# Altium schematic sheet [09] - Ethernet.SchDoc
size A3
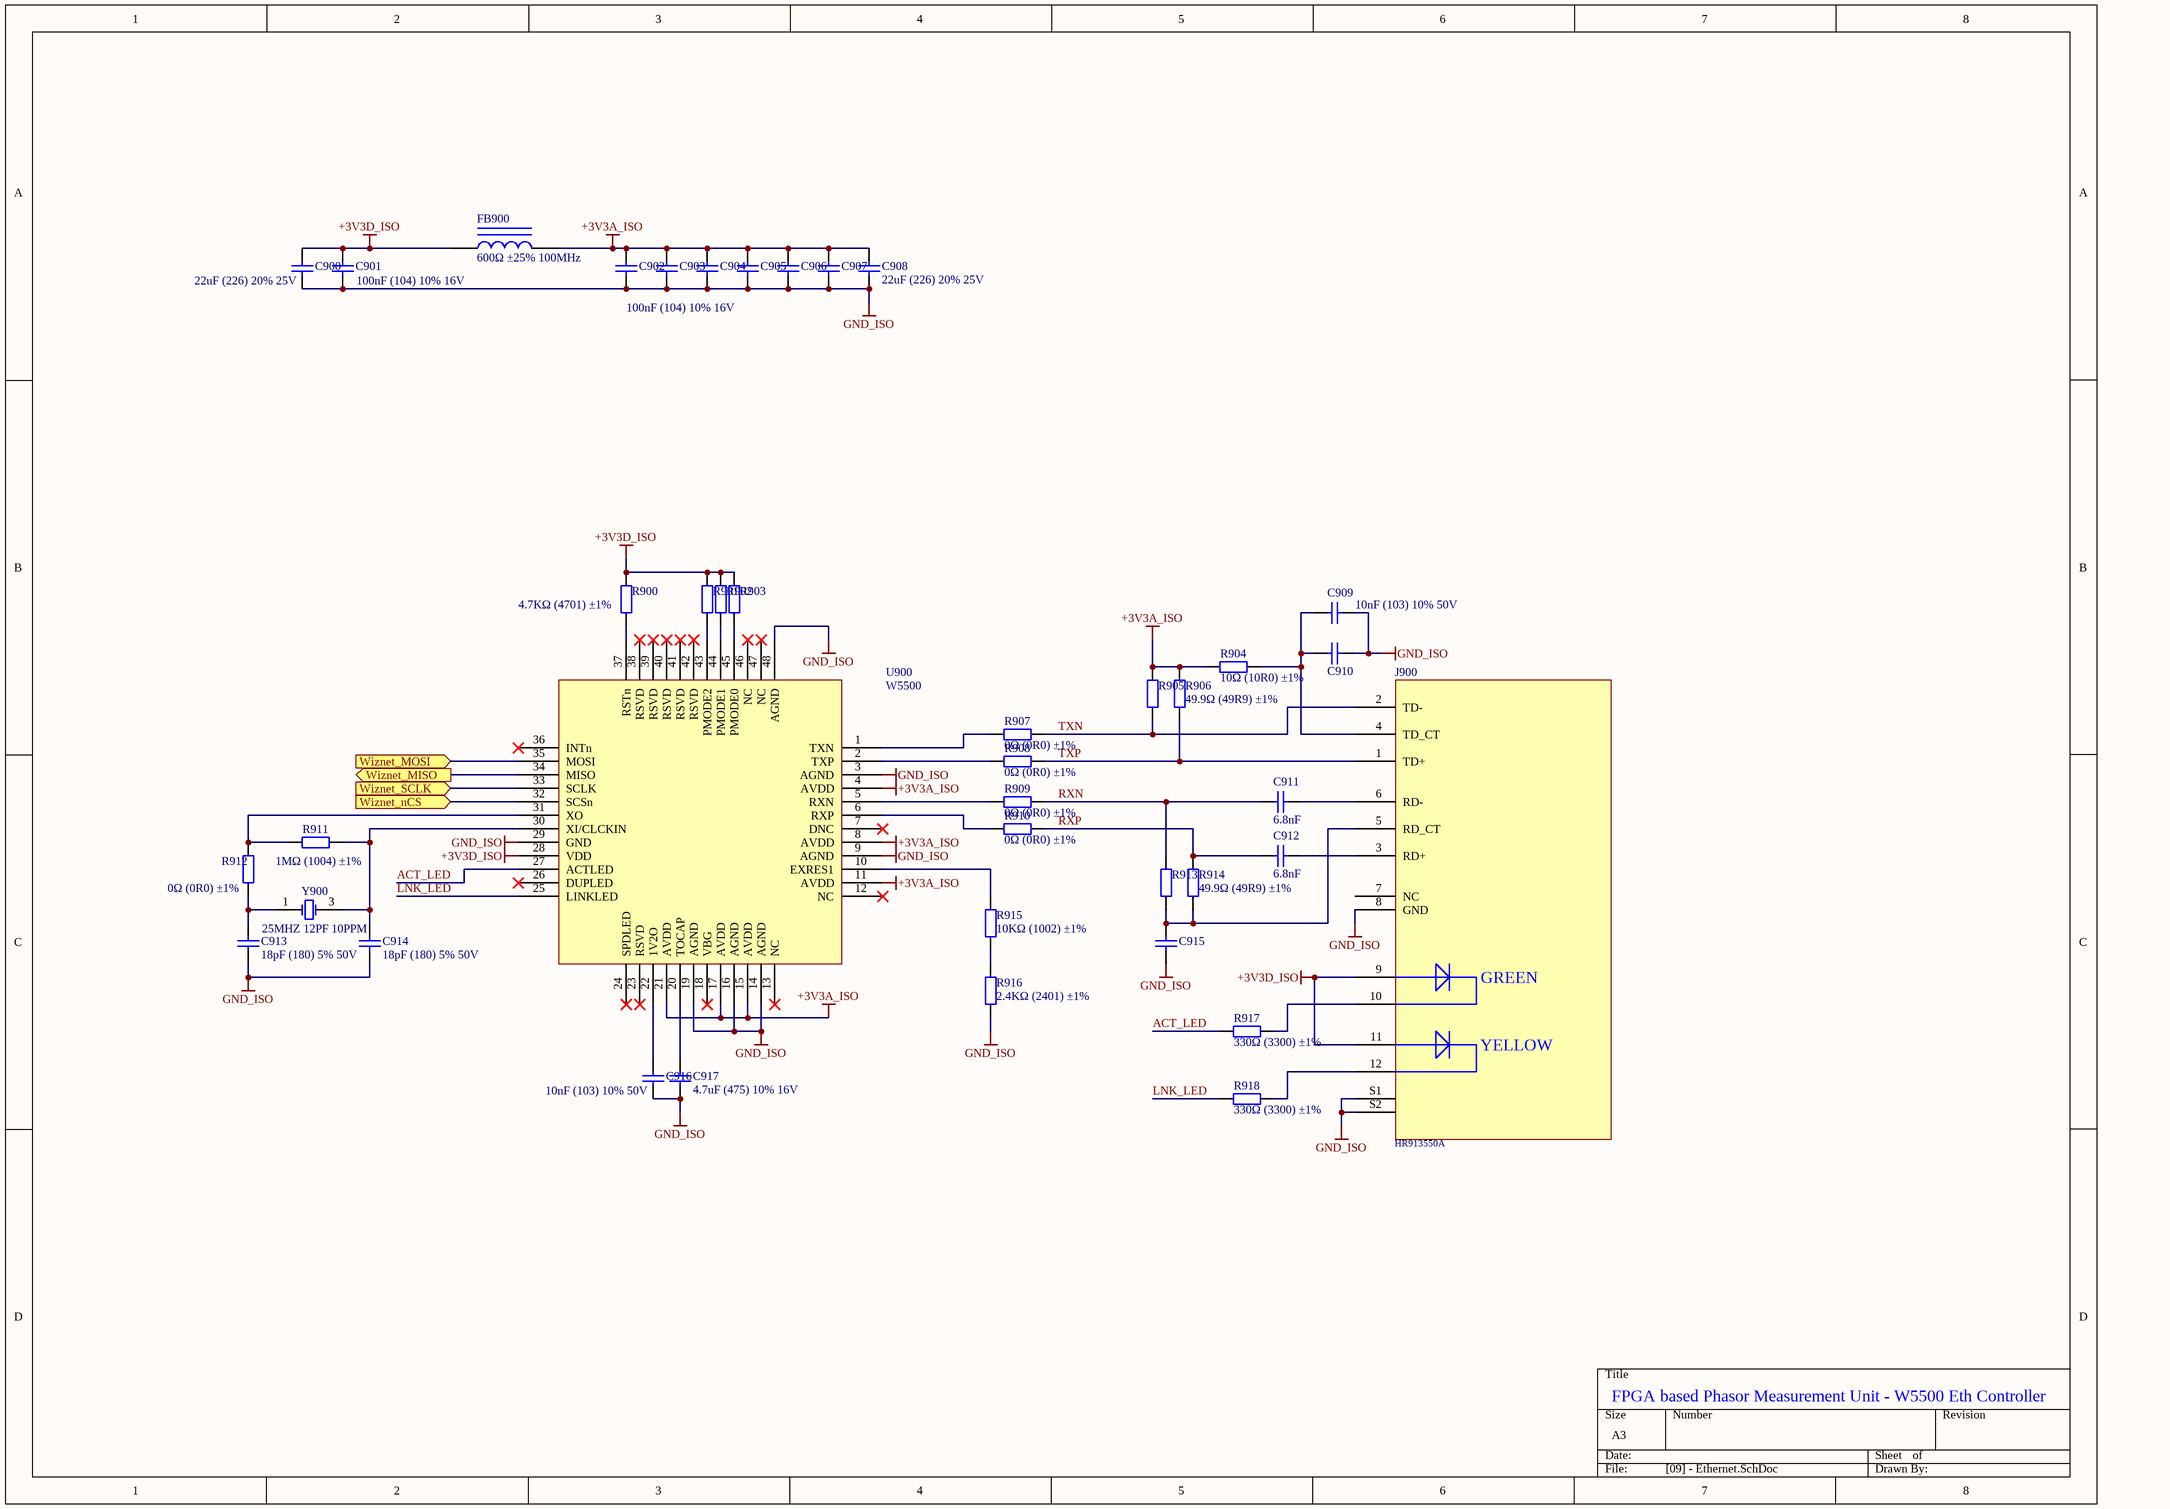
[diagram p0: [09] - Ethernet.SchDoc]

## Parts
C900  22uF (226) 20% 25V  [0805_C]
C901  100nF (104) 10% 16V  [0402_C]
C902  100nF (104) 10% 16V  [0402_C]
C903  100nF (104) 10% 16V  [0402_C]  (value not drawn)
C904  100nF (104) 10% 16V  [0402_C]  (value not drawn)
C905  100nF (104) 10% 16V  [0402_C]  (value not drawn)
C906  100nF (104) 10% 16V  [0402_C]  (value not drawn)
C907  100nF (104) 10% 16V  [0402_C]  (value not drawn)
C908  22uF (226) 20% 25V  [0805_C]
C909  10nF (103) 10% 50V  [0402_C]
C910  10nF (103) 10% 50V  [0402_C]  (value not drawn)
C911  6.8nF  [0402_C]
C912  6.8nF  [0402_C]
C913  18pF (180) 5% 50V  [0402_C]
C914  18pF (180) 5% 50V  [0402_C]
C915  10nF (103) 10% 50V  [0402_C]  (value not drawn)
C916  10nF (103) 10% 50V  [0402_C]
C917  4.7uF (475) 10% 16V  [0603_C]
FB900  600Ω ±25% 100MHz  [0805_L]
J900  HR913550A  [RJ45 MagJack]
R900  4.7KΩ (4701) ±1%  [0402_R]
R901  4.7KΩ (4701) ±1%  [0402_R]  (value not drawn)
R902  4.7KΩ (4701) ±1%  [0402_R]  (value not drawn)
R903  4.7KΩ (4701) ±1%  [0402_R]  (value not drawn)
R904  10Ω (10R0) ±1%  [0402_R]
R905  49.9Ω (49R9) ±1%  [0402_R]  (value not drawn)
R906  49.9Ω (49R9) ±1%  [0402_R]
R907  0Ω (0R0) ±1%  [0402_R]
R908  0Ω (0R0) ±1%  [0402_R]
R909  0Ω (0R0) ±1%  [0402_R]
R910  0Ω (0R0) ±1%  [0402_R]
R911  1MΩ (1004) ±1%  [0402_R]
R912  0Ω (0R0) ±1%  [0402_R]
R913  49.9Ω (49R9) ±1%  [0402_R]  (value not drawn)
R914  49.9Ω (49R9) ±1%  [0402_R]
R915  10KΩ (1002) ±1%  [0402_R]
R916  2.4KΩ (2401) ±1%  [0402_R]
R917  330Ω (3300) ±1%  [0603_R]
R918  330Ω (3300) ±1%  [0603_R]
U900  W5500  [LQFP-48_7x7x05P]
Y900  25MHZ 12PF 10PPM  [SMD-3225_4P]

## Ports
Wiznet_MISO (out), Wiznet_MOSI (in), Wiznet_nCS (in), Wiznet_SCLK (in)

## Nets
+3V3A_ISO: C902.2 C903.2 C904.2 C905.2 C906.2 C907.2 C908.2 FB900.2 R904.1 R905.2 R906.2 U900.4(AVDD) U900.8(AVDD) U900.11(AVDD) U900.15(AVDD) U900.17(AVDD) U900.21(AVDD)
+3V3D_ISO: C900.2 C901.2 FB900.1 J900.9 J900.11 R900.1 R901.2 R902.2 R903.2 U900.28(VDD)
GND_ISO: C900.1 C901.1 C902.1 C903.1 C904.1 C905.1 C906.1 C907.1 C908.1 C909.1 C910.1 C913.1 C914.1 C915.1 C916.1 C917.1 J900.8(GND) J900.S1 J900.S2 R916.1 U900.3(AGND) U900.9(AGND) U900.14(AGND) U900.16(AGND) U900.19(AGND) U900.29(GND) U900.48(AGND)
ACT_LED: R917.1 U900.27(ACTLED)
LNK_LED: R918.1 U900.25(LINKLED)
RXN: C911.1 R909.2 R913.2
RXP: C912.1 R910.2 R914.2
TXN: J900.2(TD-) R905.1 R907.2
TXP: J900.1(TD+) R906.1 R908.2
Wiznet_MISO: U900.34(MISO) ; port Wiznet_MISO
Wiznet_MOSI: U900.35(MOSI) ; port Wiznet_MOSI
Wiznet_nCS: U900.32(SCSn) ; port Wiznet_nCS
Wiznet_SCLK: U900.33(SCLK) ; port Wiznet_SCLK
NetC909_2: C909.2 C910.2 J900.4(TD_CT) R904.2
NetC911_2: C911.2 J900.6(RD-)
NetC912_2: C912.2 J900.3(RD+)
NetC913_2: C913.2 R912.1 Y900.1(OSC1)
NetC914_2: C914.2 R911.2 U900.30(XI/CLCKIN) Y900.3(OSC2)
NetC915_2: C915.2 J900.5(RD_CT) R913.1 R914.1
NetC916_2: C916.2 U900.22(1V2O)
NetC917_2: C917.2 U900.20(TOCAP)
NetJ900_10: J900.10 R917.2
NetJ900_12: J900.12 R918.2
NetR900_2: R900.2 U900.37(RSTn)
NetR901_1: R901.1 U900.43(PMODE2)
NetR902_1: R902.1 U900.44(PMODE1)
NetR903_1: R903.1 U900.45(PMODE0)
NetR907_1: R907.1 U900.1(TXN)
NetR908_1: R908.1 U900.2(TXP)
NetR909_1: R909.1 U900.5(RXN)
NetR910_1: R910.1 U900.6(RXP)
NetR911_1: R911.1 R912.2 U900.31(XO)
NetR915_1: R915.1 R916.2
NetR915_2: R915.2 U900.10(EXRES1)

Not connected (* = marked no-connect by the designer): J900 7(NC); U900 7(DNC)* 12(NC)* 13(NC)* 18(VBG)* 23(RSVD)* 24(SPDLED)* 26(DUPLED)* 36(INTn)* 38(RSVD)* 39(RSVD)* 40(RSVD)* 41(RSVD)* 42(RSVD)* 46(NC)* 47(NC)*

## Notes on the sheet
- FPGA based Phasor Measurement Unit - W5500 Eth Controller
- (in symbol HR913550A) GREEN; YELLOW

## Library data of the parts
C900 C908 = 0805 22uF (226) 20% 25V: 贴片电容; ComponentLink1Description: 供应商链接; ComponentLink1URL: http://www.szlcsc.com/product/details_46786.html; Package: 0805; Supplier: LC; SuppliersPartNumber: C45783
C901-C907 = 0402 100nF (104) 10% 16V: 贴片电容; ComponentLink1Description: 供应商链接; ComponentLink1URL: http://www.szlcsc.com/product/details_1877.html; Package: 0402; Supplier: LC; SuppliersPartNumber: C1525
C909 C910 C915 C916 = 0402 10nF (103) 10% 50V: 贴片电容; ComponentLink1Description: 供应商链接; ComponentLink1URL: http://www.szlcsc.com/product/details_15869.html; Package: 0402; Supplier: LC; SuppliersPartNumber: C15195
C911 C912 = 0402 6.8nF (682) 10% 50V: 贴片电容; ComponentLink1Description: 供应商链接; ComponentLink1URL: http://www.szlcsc.com/product/details_1894.html; Package: 0402; Supplier: LC; SuppliersPartNumber: C1542
C913 C914 = 0402 18pF (180) 5% 50V: 贴片电容; ComponentLink1Description: 供应商链接; ComponentLink1URL: http://www.szlcsc.com/product/details_1901.html; Package: 0402; Supplier: LC; SuppliersPartNumber: C1549
C917 = 0603 4.7uF (475) 10% 16V: 贴片电容; ComponentLink1Description: 供应商链接; ComponentLink1URL: http://www.szlcsc.com/product/details_20375.html; Package: 0603; Supplier: LC; SuppliersPartNumber: C19666
FB900 = 0805 600Ω 25% 100MHz: 贴片磁珠; ComponentLink1Description: 供应商链接; ComponentLink1URL: http://www.szlcsc.com/product/details_1369.html; Package: 0805; Supplier: LC; SuppliersPartNumber: C1017
J900 = HR913550A: RJ45 12 1 Green - Yellow Through Hole Ethernet Connectors/Modular Connectors (RJ45 RJ11) RoHS; JLCPCB: NO; SuppliersPartNumber: C163507
R900-R903 = 0402 4.7KΩ (4701) 1%: 贴片电阻; ComponentLink1Description: 供应商链接; ComponentLink1URL: http://www.szlcsc.com/product/details_26643.html; Package: 0402; Supplier: LC; SuppliersPartNumber: C25900
R904 = 0402 10Ω (10R0) 1%: 贴片电阻; ComponentLink1Description: 供应商链接; ComponentLink1URL: http://www.szlcsc.com/product/details_25820.html; Package: 0402; Supplier: LC; SuppliersPartNumber: C25077
R905 R906 R913 R914 = 0402 49.9Ω (49R9) 1%: 贴片电阻; ComponentLink1Description: 供应商链接; ComponentLink1URL: http://www.szlcsc.com/product/details_25863.html; Package: 0402; Supplier: LC; SuppliersPartNumber: C25120
R907-R910 R912 = 0402 0Ω (0R0) 1%: 贴片电阻; ComponentLink1Description: 供应商链接; ComponentLink1URL: http://www.szlcsc.com/product/details_17853.html; Package: 0402; Supplier: LC; SuppliersPartNumber: C17168
R911 = 0402 1MΩ (1004) 1%: 贴片电阻; ComponentLink1Description: 供应商链接; ComponentLink1URL: http://www.szlcsc.com/product/details_26826.html; Package: 0402; Supplier: LC; SuppliersPartNumber: C26083
R915 = 0402 10KΩ (1002) 1%: 贴片电阻; ComponentLink1Description: 供应商链接; ComponentLink1URL: http://www.szlcsc.com/product/details_26487.html; Package: 0402; Supplier: LC; SuppliersPartNumber: C25744
R916 = 0402 2.4KΩ (2401) 1%: 贴片电阻; ComponentLink1Description: 供应商链接; ComponentLink1URL: http://www.szlcsc.com/product/details_26625.html; Package: 0402; Supplier: LC; SuppliersPartNumber: C25882
R917 R918 = 0603 330Ω (3300) 1%: 贴片电阻; ComponentLink1Description: 供应商链接; ComponentLink1URL: http://www.szlcsc.com/product/details_23865.html; Package: 0603; Supplier: LC; SuppliersPartNumber: C23138
U900 = W5500_[C32843]: 以太网; ComponentLink1Description: 供应商链接; ComponentLink1URL: http://www.szlcsc.com/product/details_33808.html; Package: LQFP-48_7x7x05P; Supplier: LC; SuppliersPartNumber: C32843
Y900 = SMD-3225_4P  25MHZ 12PF 10PPM: 贴片晶振; ComponentLink1Description: 供应商链接; ComponentLink1URL: http://www.szlcsc.com/product/details_9526.html; Package: SMD-3225_4P; Supplier: LC; SuppliersPartNumber: C9006